# Altium schematic sheet 最小系统.SchDoc
size A4
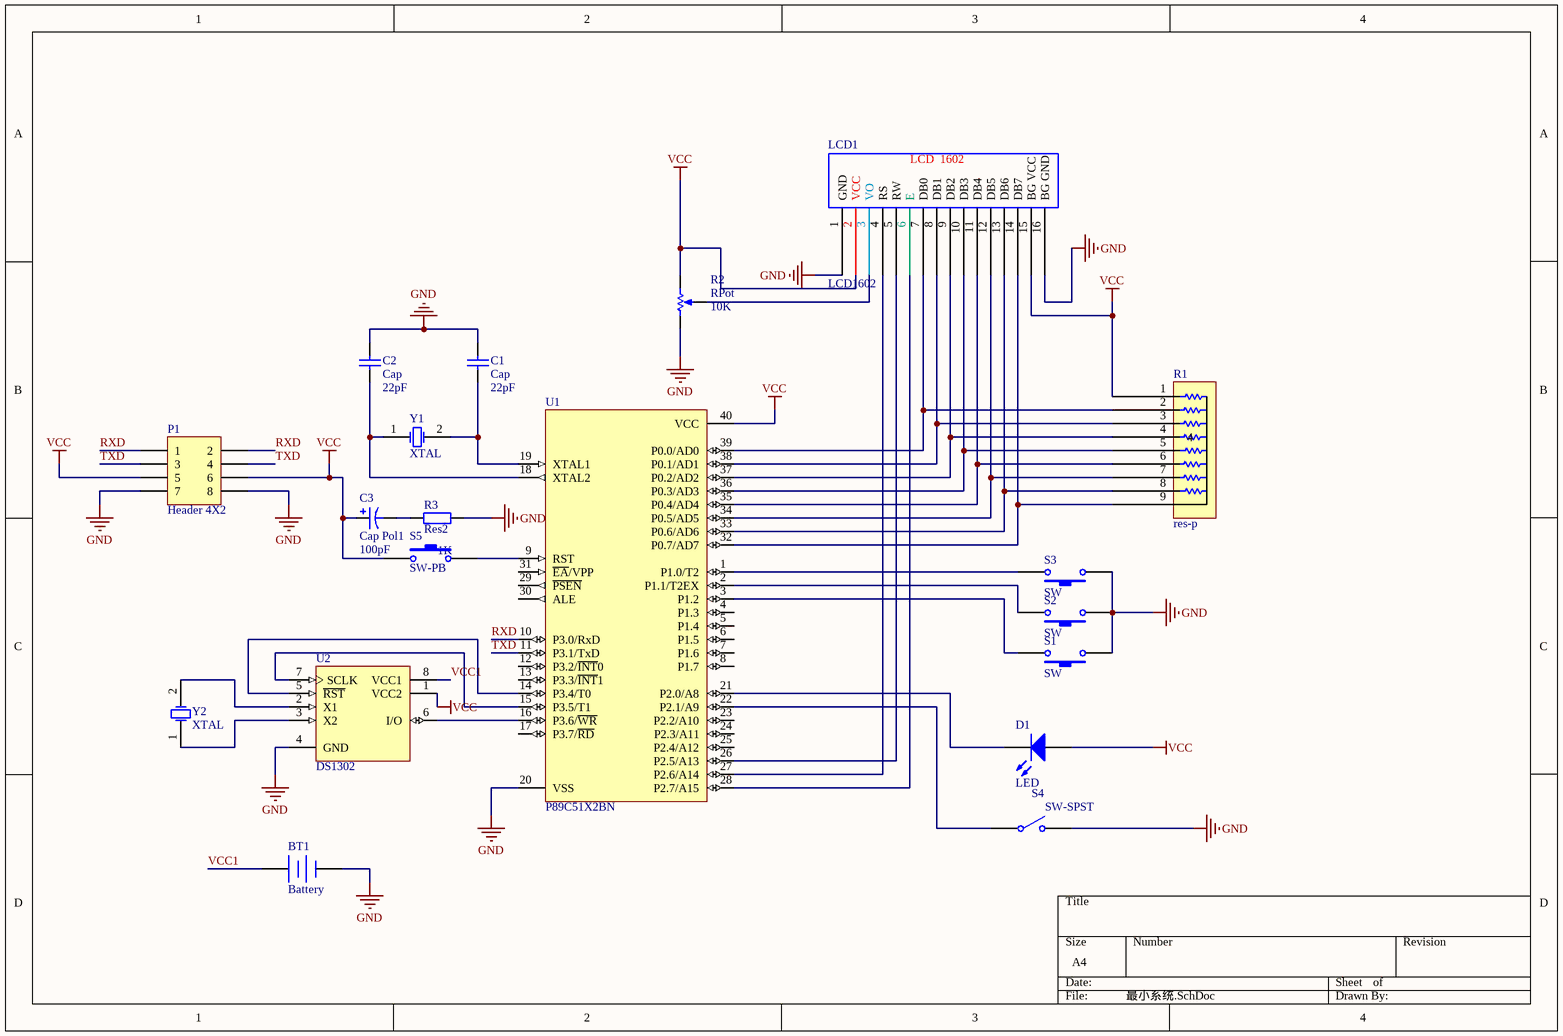
[diagram p0: 最小系统.SchDoc]

## Parts
BT1  Battery  [BAT-2]
C1  Cap  value 22pF  [CAPR2.54-5.1x3.2]
C2  Cap  value 22pF  [CAPR2.54-5.1x3.2]
C3  Cap Pol1  value 100pF  [RB7.6-15]
D1  LED  [LED-1]
LCD1  LCD1602  [1602LCD]
P1  Header 4X2  [HDR2X4]
R1  res-p  [HDR1X9]
R2  RPot  value 10K  [VR5]
R3  Res2  value 1K  [AXIAL-0.4]
S1  SW  [SW/PB-V4/H7.1]
S2  SW  [SW/PB-V4/H7.1]
S3  SW  [SW/PB-V4/H7.1]
S4  SW-SPST  [SPST-2]
S5  SW-PB  [SW/PB-V4/H7.1]
U1  P89C51X2BN  [SOT129-1]
U2  DS1302  [DIP8]
Y1  XTAL  [BCY-W2/D3.1]
Y2  XTAL  [BCY-W2/D3.1]

## Nets
GND: BT1.2(-) C1.2 C2.2 LCD1.1(GND) LCD1.16(BG_GND) P1.7 P1.8 R2.1(TOP) R3.2 S1.1 S2.1 S3.1 S4.2(NO) U1.20(VSS) U2.4(GND)
VCC: C3.1 D1.1(A) LCD1.2(VCC) LCD1.15(BG_VCC) P1.5 P1.6 R1.1 R2.2(BOT) S5.1 U1.40(VCC) U2.1(VCC2)
RXD: P1.1 P1.2 U1.10(P3.0/RxD)
TXD: P1.3 P1.4 U1.11(P3.1/TxD)
VCC1: BT1.1(+) U2.8(VCC1)
NetC1_1: C1.1 U1.19(XTAL1) Y1.2(OSC2)
NetC2_1: C2.1 U1.18(XTAL2) Y1.1(OSC1)
NetC3_2: C3.2 R3.1
NetD1_2: D1.2(K) U1.21(P2.0/A8)
NetLCD1_3: LCD1.3(VO) R2.3(TAP)
NetLCD1_4: LCD1.4(RS) U1.27(P2.6/A14)
NetLCD1_5: LCD1.5(RW) U1.26(P2.5/A13)
NetLCD1_6: LCD1.6(E) U1.28(P2.7/A15)
NetLCD1_7: LCD1.7(DB0) R1.2 U1.39(P0.0/AD0)
NetLCD1_8: LCD1.8(DB1) R1.3 U1.38(P0.1/AD1)
NetLCD1_9: LCD1.9(DB2) R1.4 U1.37(P0.2/AD2)
NetLCD1_10: LCD1.10(DB3) R1.5 U1.36(P0.3/AD3)
NetLCD1_11: LCD1.11(DB4) R1.6 U1.35(P0.4/AD4)
NetLCD1_12: LCD1.12(DB5) R1.7 U1.34(P0.5/AD5)
NetLCD1_13: LCD1.13(DB6) R1.8 U1.33(P0.6/AD6)
NetLCD1_14: LCD1.14(DB7) R1.9 U1.32(P0.7/AD7)
NetS1_2: S1.2 U1.3(P1.2)
NetS2_2: S2.2 U1.2(P1.1/T2EX)
NetS3_2: S3.2 U1.1(P1.0/T2)
NetS4_1: S4.1(COMMON) U1.22(P2.1/A9)
NetS5_2: S5.2 U1.9(RST)
NetU1_14: U1.14(P3.4/T0) U2.5(~{RST})
NetU1_15: U1.15(P3.5/T1) U2.7(SCLK)
NetU1_16: U1.16(P3.6/~{WR}) U2.6(I/O)
NetU2_2: U2.2(X1) Y2.2(OSC2)
NetU2_3: U2.3(X2) Y2.1(OSC1)

Not connected (* = marked no-connect by the designer): U1 4(P1.3) 5(P1.4) 6(P1.5) 7(P1.6) 8(P1.7) 12(P3.2/~{INT}0) 13(P3.3/~{INT}1) 17(P3.7/~{RD}) 23(P2.2/A10) 24(P2.3/A11) 25(P2.4/A12) 29(~{PSEN}) 30(ALE) 31(~{EA}/VPP)

## Notes on the sheet
- (in symbol LCD1602) LCD  1602

## Library data of the parts
BT1 = Battery: Multicell Battery; Published: 24-Mar-1999; LatestRevisionDate: 17-Jul-2002; LatestRevisionNote: Re-released for DXP Platform.; Publisher: Altium Limited
C1 C2 = Cap: Capacitor; Published: 8-Jun-2000; LatestRevisionDate: 17-Jul-2002; LatestRevisionNote: Re-released for DXP Platform.; PackageReference: RAD-0.3; Publisher: Altium Limited
C3 = Cap Pol1: Polarized Capacitor (Radial); Published: 8-Jun-2000; LatestRevisionDate: 17-Jul-2002; LatestRevisionNote: Re-released for DXP Platform.; Publisher: Altium Limited
P1 = Header 4X2: Header, 4-Pin, Dual row; LatestRevisionDate: 17-Jul-2002; LatestRevisionNote: Re-released for DXP Platform.; Publisher: Altium Limited
R2 = RPot: Potentiometer; Sim Note: Enter the Resistance value and the set point into parameter fields.; Set Position: 0.5; Published: 8-Jun-2000; LatestRevisionDate: 17-Jul-2002; LatestRevisionNote: Re-released for DXP Platform.; Publisher: Altium Limited
R3 = Res2: Resistor; Published: 8-Jun-2000; LatestRevisionDate: 17-Jul-2002; LatestRevisionNote: Re-released for DXP Platform.; Publisher: Altium Limited
S1-S3 = S
S4 = SW-SPST: Single-Pole, Single-Throw Switch; Published: 24-Mar-1999; LatestRevisionDate: 17-Jul-2002; LatestRevisionNote: Re-released for DXP Platform.; PackageReference: SPST-2; Publisher: Altium Limited
S5 = SW-PB: Switch; Published: 24-Mar-1999; LatestRevisionDate: 17-Jul-2002; LatestRevisionNote: Re-released for DXP Platform.; Publisher: Altium Limited
U1 = P89C51X2BN: 80C51 8-Bit Flash Microcontroller Family, 4 kB Flash; Published: 21-May-2003; DatasheetVersion: 5-Jun-2002; PackageVersion: Aug-2000; PackageReference: SOT129-1; Publisher: Altium Limited; PackageDescription: DIP, Plastic; 40 Leads; Row Spacing 15.24 mm; Pitch 2.54 mm; Code_JEDEC: MO-015; ComponentLink1Description: Manufacturer Link; ComponentLink1URL: http://www-us2.semiconductors.philips.com/; ComponentLink2Description: Datasheet; ComponentLink2URL: http://www.semiconductors.philips.com/acrobat/datasheets/P89C5XX2_2.pdf
U2 = DS1302: Trickle Charge Timekeeping Chip; Published: 13-Oct-2000; LatestRevisionDate: 06-Jun-2005; LatestRevisionNote: Stylized 3D Model Added.; DatasheetVersion: 2-Jul-1999; PackageVersion: 1999; PackageReference: DIP8; Publisher: Altium Limited; PackageDescription: DIP; 8 Leads; Row Spacing 7.62 mm; Pitch 2.54 mm; ComponentLink1Description: Manufacturer Link; ComponentLink1URL: http://www.maxim-ic.com/; ComponentLink2Description: Datasheet; ComponentLink2URL: http://pdfserv.maxim-ic.com/en/ds/DS1302.pdf
Y1 Y2 = XTAL: Crystal Oscillator; Published: 8-Jun-2000; LatestRevisionDate: 17-Jul-2002; LatestRevisionNote: Re-released for DXP Platform.; PackageReference: R38; Publisher: Altium Limited